# Altium schematic sheet Sheet4.SchDoc
size A3
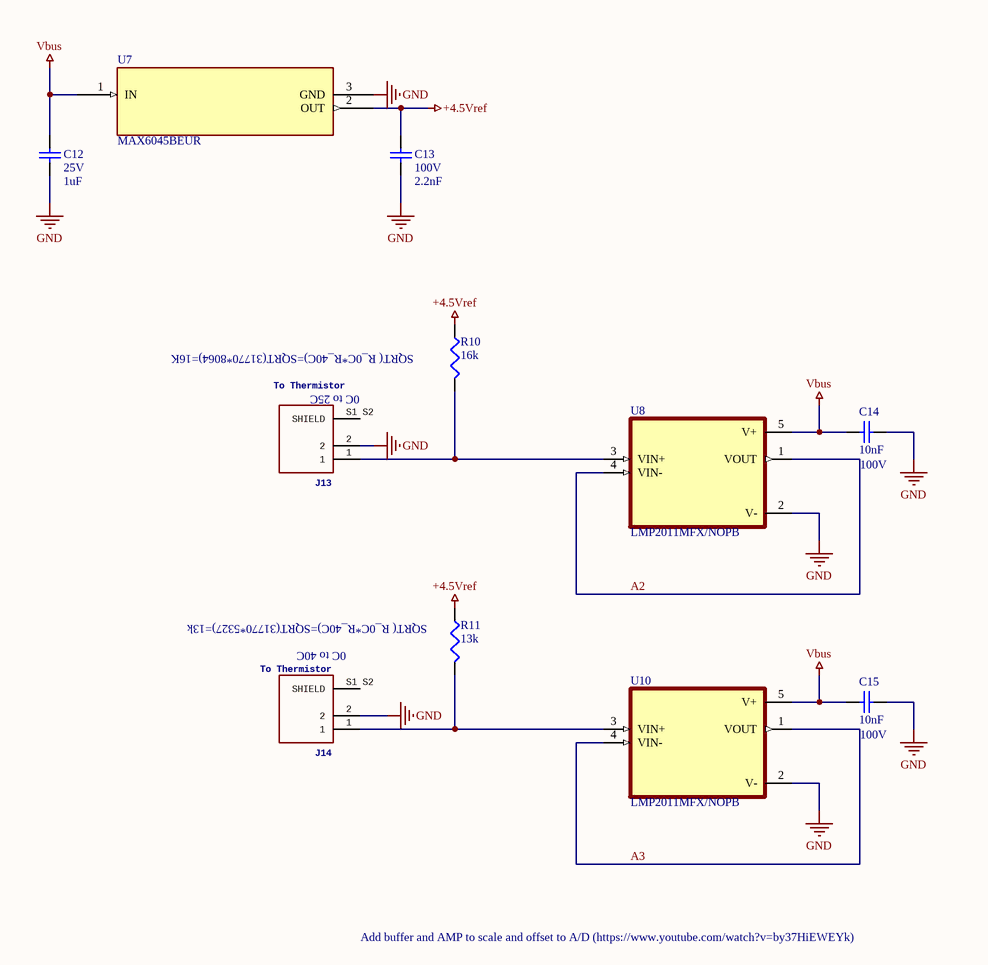
[diagram p0: Sheet4.SchDoc]

## Parts
C12  25V  value 1uF  [1608[0603]]
C13  100V  value 2.2nF  [1608[0603]]
C14  100V  value 10nF  [1608[0603]]
C15  100V  value 10nF  [1608[0603]]
J13  To Thermistor  [CONN_BM04B-SRSS-TB(LF)(SN)]
J14  To Thermistor  [CONN_BM04B-SRSS-TB(LF)(SN)]
R10  value 16k  [J1-0603]  (hidden comment: Res3)
R11  value 13k  [J1-0603]  (hidden comment: SQRT( R_0C*R_40C))
U7  MAX6045BEUR  [21-0051H]
U8  LMP2011MFX/NOPB  [SOT95P280X145-5N]
U10  LMP2011MFX/NOPB

## Nets
+4.5Vref: C13.2 R10.1 R11.1 U7.2(OUT)
GND: C12.1 C13.1 C14.1 C15.1 J13.2 J14.2 U7.3(GND) U8.2(V-) U10.2(V-)
Vbus: C12.2 C14.2 C15.2 U7.1(IN) U8.5(V+) U10.5(V+)
A2: U8.1(VOUT) U8.4(VIN-)
A3: U10.1(VOUT) U10.4(VIN-)
NetJ13_1: J13.1 R10.2 U8.3(VIN+)
NetJ14_1: J14.1 R11.2 U10.3(VIN+)

Not connected (* = marked no-connect by the designer): J13 S1 S2(SHIELD); J14 S1 S2(SHIELD)

## Notes on the sheet
- SQRT( R_0C*R_40C)=SQRT(31770*8064)=16K
- (near J13) 0C to 25C
- (near R11) SQRT( R_0C*R_40C)=SQRT(31770*5327)=13k
- (near J14) 0C to 40C
- Add buffer and AMP to scale and offset to A/D (https://www.youtube.com/watch?v=by37HiEWEYk)
- Title
- Size:
- Date:
- A3
- Number:
- Time:
- Revision:
- Sheet
- of
- File:

## Library data of the parts
C12 = Cap Semi: CAP CER 1UF 25V X7R 0603; Manufacturer Part #: AC0603KRX7R8BB105; Manufacturer: YAGEO; Footprints: 0603
C13 = Cap Semi: CAP CER 2200PF 100V X7R 0603; Manufacturer Part #: CC0603KRX7R0BB222; Manufacturer: YAGEO; Footprints: 0603
C14 C15 = Cap Semi: CAP CER 10000PF 100V X7R 0603; Manufacturer: YAGEO; Manufacturer Part #: CC0603KRX7R0BB103; Footprints: 0603
J13 J14 = BM04B-SRSS-TB(LF)(SN): Manufacturer: JST Sales; Manufacturer Part #: BM04B-SRSS-TB(LF)(SN)
R10 = Res3: Resistor, 0.1%, 1/10W; Manufacturer Part #: ERA-3AEB163V; Manufacturer: Panasonic Electronic Components; Footprints: 0603
R11 = Res3: Resistor, 0.1%, 1/5W; Manufacturer Part #: ERJ-PB3B1302V; Manufacturer: Panasonic Electronic Components; Footprints: 0603
U7 = MAX6045AEUR: Voltage References Precision, Low-Power, Low-Dropout, SOT23-3 Voltage References; Manufacturer: Analog Devices Inc./Maxim Integrated; Manufacturer Part #: MAX6045BEUR
U8 U10 = LMP2011MFX/NOPB: Single, High Precision, Rail-to-Rail Output Operational Amplifier; Manufacturer: Texas Instruments; Manufacturer Part #: LMP2011MFX/NOPB